# EAGLE design arduino (EAGLE 6.2)
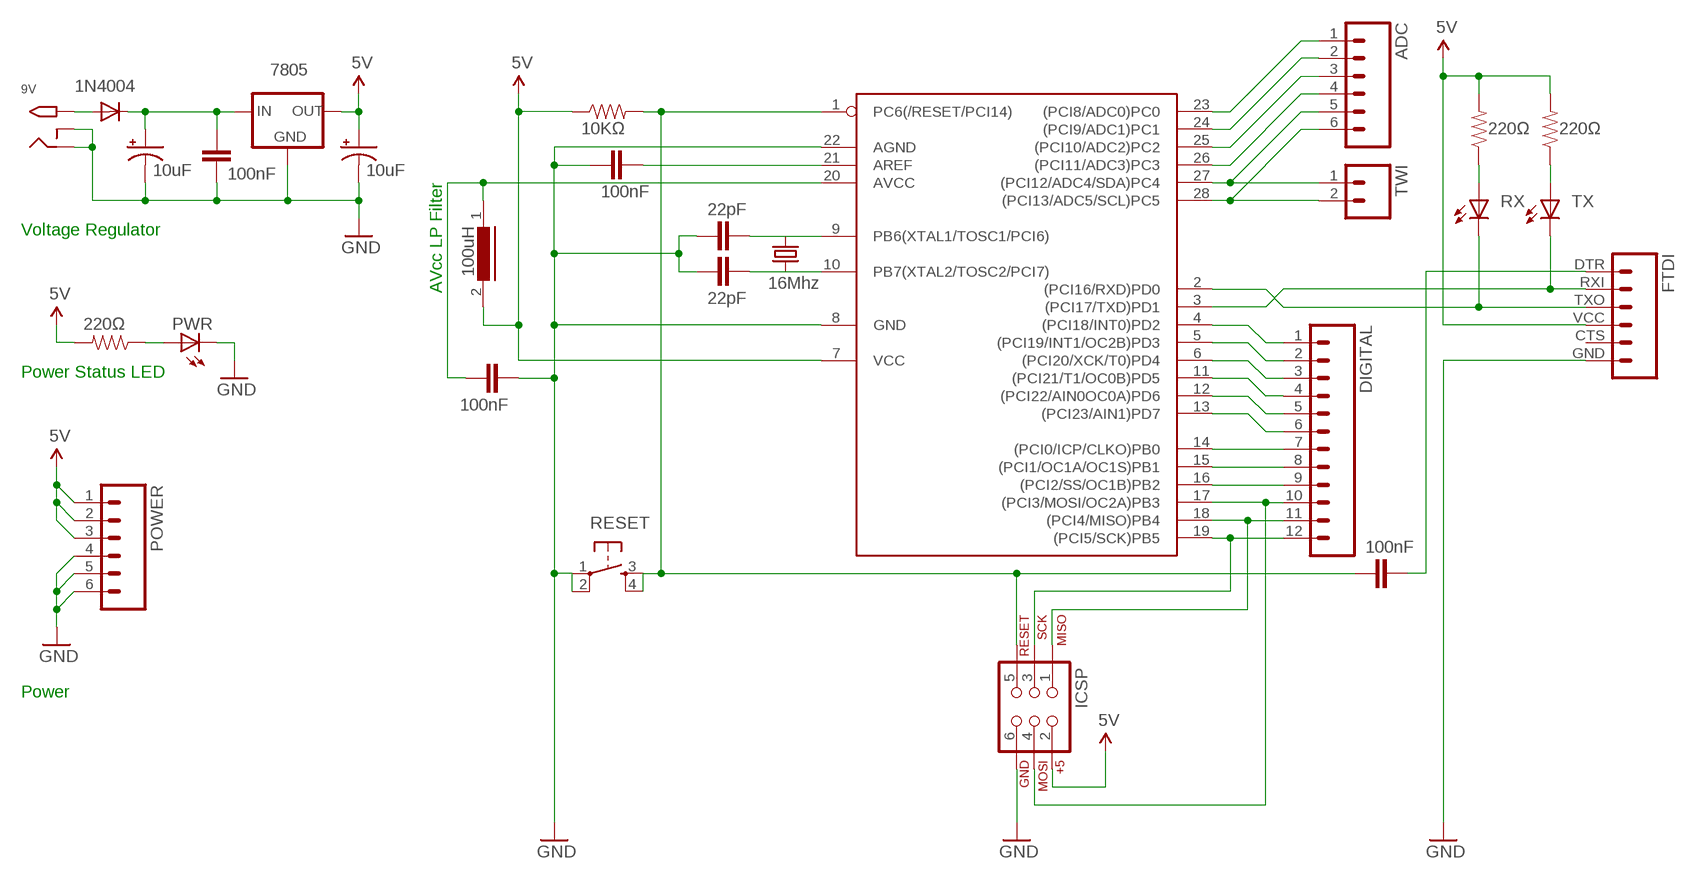
[diagram p0: schematic, sheet 1]

## Parts
9V  2.1MMJACKTHM  [PJ-102A]
ADC  M06LOCK  [1X06_LOCK]
AVR_C1  100nF  CAPPTH1  [CAP-PTH-5MM]
AVR_C2  22pF  CAPPTH1  [CAP-PTH-5MM]
AVR_C3  22pF  CAPPTH1  [CAP-PTH-5MM]
AVR_C4  100nF  CAPPTH1  [CAP-PTH-5MM]
AVR_C5  100nF  CAPPTH1  [CAP-PTH-5MM]
AVR_R1  10KΩ  RESISTORPTH-1/4W  [AXIAL-0.4]
AVR_R2  220Ω  RESISTORPTH-1/4W  [AXIAL-0.4]
AVR_R3  220Ω  RESISTORPTH-1/4W  [AXIAL-0.4]
D1  1N4004  [DO41-10]
DIGITAL  M12LOCK  [1X12_LOCK]
FTDI  FTDI_BASICPTH  [FTDI_BASIC]
IC1  ATMEGA168-20P  [DIL28-3]
IC2  7805  V_REG_78XXSIDE  [78XXL]
ICSP  AVR_SPI_PRG_62X3_LOCK  [2X3_LOCK]
L1  100uH  MCC10  [MCC10]
POWER  M06LOCK  [1X06_LOCK]
PWR  LED5MM  [LED5MM]
PWR_C1  10uF  CAP_POLPTH2  [CPOL-RADIAL-10UF-25V]
PWR_C2  100nF  CAPPTH1  [CAP-PTH-5MM]
PWR_C3  10uF  CAP_POLPTH2  [CPOL-RADIAL-10UF-25V]
PWR_R1  220Ω  RESISTORPTH-1/4W  [AXIAL-0.4]
Q1  16Mhz  CRYSTALHC49S  [HC49/S]
RESET  TAC_SWITCHPTH  [TACTILE-PTH]
RX  LED5MM  [LED5MM]
TWI  M02LOCK  [1X02_LOCK]
TX  LED5MM  [LED5MM]

## Nets
5V: AVR_R1.P$1 AVR_R2.P$2 AVR_R3.P$2 FTDI.VCC IC1.7(VCC) IC2.OUT ICSP.2 L1.2 POWER.1 POWER.2 POWER.3 PWR_C3.1(+) PWR_R1.P$2
ADC0: ADC.1 IC1.23((PCI8/ADC0)PC0)
ADC1: ADC.2 IC1.24((PCI9/ADC1)PC1)
ADC2: ADC.3 IC1.25((PCI10/ADC2)PC2)
ADC3: ADC.4 IC1.26((PCI11/ADC3)PC3)
AREF: AVR_C1.2 IC1.21(AREF)
AVCC: AVR_C4.2 IC1.20(AVCC) L1.1
GND: 9V.RING 9V.RING_SW AVR_C1.1 AVR_C2.1 AVR_C3.1 AVR_C4.1 FTDI.GND IC1.8(GND) IC1.22(AGND) IC2.GND ICSP.6 POWER.4 POWER.5 POWER.6 PWR.K(C) PWR_C1.2(-) PWR_C2.1 PWR_C3.2(-) RESET.1 RESET.2
MISO: DIGITAL.11 IC1.18((PCI4/MISO)PB4) ICSP.1
MOSI: DIGITAL.10 IC1.17((PCI3/MOSI/OC2A)PB3) ICSP.4
N$1: AVR_R2.P$1 RX.A
N$2: AVR_R3.P$1 TX.A
N$4: PWR.A PWR_R1.P$1
N$11: AVR_C5.2 FTDI.DTR
N$16: 9V.TIP D1.A
N$23: DIGITAL.1 IC1.4((PCI18/INT0)PD2)
N$24: DIGITAL.2 IC1.5((PCI19/INT1/OC2B)PD3)
N$25: DIGITAL.3 IC1.6((PCI20/XCK/T0)PD4)
N$26: DIGITAL.4 IC1.11((PCI21/T1/OC0B)PD5)
N$27: DIGITAL.5 IC1.12((PCI22/AIN0OC0A)PD6)
N$28: DIGITAL.6 IC1.13((PCI23/AIN1)PD7)
N$29: DIGITAL.7 IC1.14((PCI0/ICP/CLKO)PB0)
N$30: DIGITAL.8 IC1.15((PCI1/OC1A/OC1S)PB1)
N$31: DIGITAL.9 IC1.16((PCI2/SS/OC1B)PB2)
RESET: AVR_C5.1 AVR_R1.P$2 IC1.1(PC6(/RESET/PCI14)) ICSP.5 RESET.3 RESET.4
RX: FTDI.TXO IC1.2((PCI16/RXD)PD0) RX.K(C)
SCK: DIGITAL.12 IC1.19((PCI5/SCK)PB5) ICSP.3
SCL: ADC.6 IC1.28((PCI13/ADC5/SCL)PC5) TWI.2
SDA: ADC.5 IC1.27((PCI12/ADC4/SDA)PC4) TWI.1
TX: FTDI.RXI IC1.3((PCI17/TXD)PD1) TX.K(C)
VCC: D1.C IC2.IN PWR_C1.1(+) PWR_C2.2
XTAL1: AVR_C2.2 IC1.9(PB6(XTAL1/TOSC1/PCI6)) Q1.2
XTAL2: AVR_C3.2 IC1.10(PB7(XTAL2/TOSC2/PCI7)) Q1.1
Unconnected: FTDI.CTS

## Notes on the sheet
- AVcc LP Filter
- Voltage Regulator
- Power Status LED
- Power

## Library data of the parts
9V = adafruit:2.1MMJACK: 2.1mm x 5.5mm THM DC jack with internal switch. Digikey part #PJ-102A, 4UCON part #05537 2.1mm x 5.5mm SMT DC jack with internal switch. Digikey part #PJ-002A-SMT, 4UCON part #03267 By microbuilder.eu & adafruit.com
ADC POWER = SparkFun:M06: Header 6 Standard 6-pin 0.1" header. Use with straight break away headers (SKU : PRT-00116), right angle break away headers (PRT-00553), swiss pins (PRT-00743), machine pins (PRT-00117), and female headers (PRT-00115). Molex polarized connector foot print use with SKU : PRT-08094 with associated crimp pins and housings. NOTES ON THE VARIANTS LOCK and LOCK_LONGPADS... This footprint was designed to help hold the alignment of a through-hole component (i.e. 6-pin header) while soldering it into place. You may notice that each hole has been shifted either up or down by 0.005 of an inch from it's more standard position (which is a perfectly straight line). This slight alteration caused the pins (the squares in the middle) to touch the edges of the holes. Because they are alternating, it causes a "brace" to hold the component in place. 0.005 has proven to be the perfect amount of "off-center" position when using our standard breakaway headers. Although looks a little odd when you look at the bare footprint, once you have a header in there, the alteration is very hard to notice. Also, if you push a header all the way into place, it is covered up entirely on the bottom side. This idea of altering the position of holes to aid alignment will be further integrated into the Sparkfun Library for other footprints. It can help hold any component with 3 or more connection pins.
AVR_C1-AVR_C5 PWR_C2 = SparkFun:CAP: Capacitor Standard 0603 ceramic capacitor, and 0.1" leaded capacitor.
AVR_R1-AVR_R3 PWR_R1 = SparkFun:RESISTOR: Resistor Basic schematic elements and footprints for 0603, 1206, and PTH resistors.
D1 = diode:1N4004: DIODE general purpose rectifier, 1 A
DIGITAL = SparkFun:M12: Header 12 Standard 12-pin 0.1" header. Use with straight break away headers (SKU : PRT-00116), right angle break away headers (PRT-00553), swiss pins (PRT-00743), machine pins (PRT-00117), and female headers (PRT-00115).
FTDI = SparkFun:FTDI_BASIC: FTDI Basic: 3.3V and 5V
IC1 = adafruit:ATMEGA168*P: MICROCONTROLLER 16 kBytes FLASH 1 kBytes SRAM 512 Bytes EEPROM USART 8-channel 10 bit ADC
IC2 = SparkFun:V_REG_78XX: Voltage Regulator Standard 7805 5V regulator. IGO (Input Ground Output). Spark Fun Electronics SKU : COM-00107
ICSP = SparkFun:AVR_SPI_PRG_6: AVR ISP 6 Pin This is the reduced ISP connector for AVR programming. Common on Arduino. This footprint will take up less PCB space and can be used with a 10-pin to 6-pin adapter such as SKU: BOB-08508
L1 = inductors:MCC10: INDUCTOR
PWR RX TX = adafruit:LED: LED OSRAM: - CHIPLED LG R971, LG N971, LY N971, LG Q971, LY Q971, LO R971, LY R971 LH N974, LH R974 LS Q976, LO Q976, LY Q976 LO Q996 - Hyper CHIPLED LW Q18S LB Q993, LB Q99A, LB R99A - SideLED LS A670, LO A670, LY A670, LG A670, LP A670 LB A673, LV A673, LT A673, LW A673 LH A674 LY A675 LS A676, LA A676, LO A676, LY A676, LW A676 LS A679, LY A679, LG A679 - Hyper Micro SIDELED® LS Y876, LA Y876, LO Y876, LY Y876 LT Y87S - SmartLED LW L88C, LW L88S LB L89C, LB L89S, LG L890 LS L89K, LO L89K, LY L89K LS L896, LA L896, LO L896, LY L896 - TOPLED LS T670, LO T670, LY T670, LG T670, LP T670 LSG T670, LSP T670, LSY T670, LOP T670, LYG T670 LG T671, LOG T671, LSG T671 LB T673, LV T673, LT T673, LW T673 LH T674 LS T676, LA T676, LO T676, LY T676, LB T676, LH T676, LSB T676, LW T676 LB T67C, LV T67C, LT T67C, LS T67K, LO T67K, LY T67K, LW E67C LS E67B, LA E67B, LO E67B, LY E67B, LB E67C, LV E67C, LT E67C LW T67C LS T679, LY T679, LG T679 LS T770, LO T770, LY T770, LG T770, LP T770 LB T773, LV T773, LT T773, LW T773 LH T774 LS E675, LA E675, LY E675, LS T675 LS T776, LA T776, LO T776, LY T776, LB T776 LHGB T686 LT T68C, LB T68C - Hyper Mini TOPLED® LB M676 - Mini TOPLED Santana® LG M470 LS M47K, LO M47K, LY M47K Source: http://www.osram.convergy.de/
PWR_C1 PWR_C3 = SparkFun:CAP_POL: Capacitor Polarized These are standard SMD and PTH capacitors. Normally 10uF, 47uF, and 100uF in electrolytic and tantalum varieties. Always verify the external diameter of the through hole cap, it varies with capacity, voltage, and manufacturer. The EIA devices should be standard.
Q1 = crystal:CRYSTAL: CRYSTAL; OC_FARNELL: 1667008; OC_NEWARK: unknown
RESET = SparkFun:TAC_SWITCH: Momentary Switch Button commonly used for reset or general input. Spark Fun Electronics SKU : COM-00097
TWI = SparkFun:M02: Header 2 Standard 2-pin 0.1" header. Use with straight break away headers (SKU : PRT-00116), right angle break away headers (PRT-00553), swiss pins (PRT-00743), machine pins (PRT-00117), and female headers (PRT-00115). Molex polarized connector foot print use with SKU : PRT-08233 with associated crimp pins and housings.

## Board
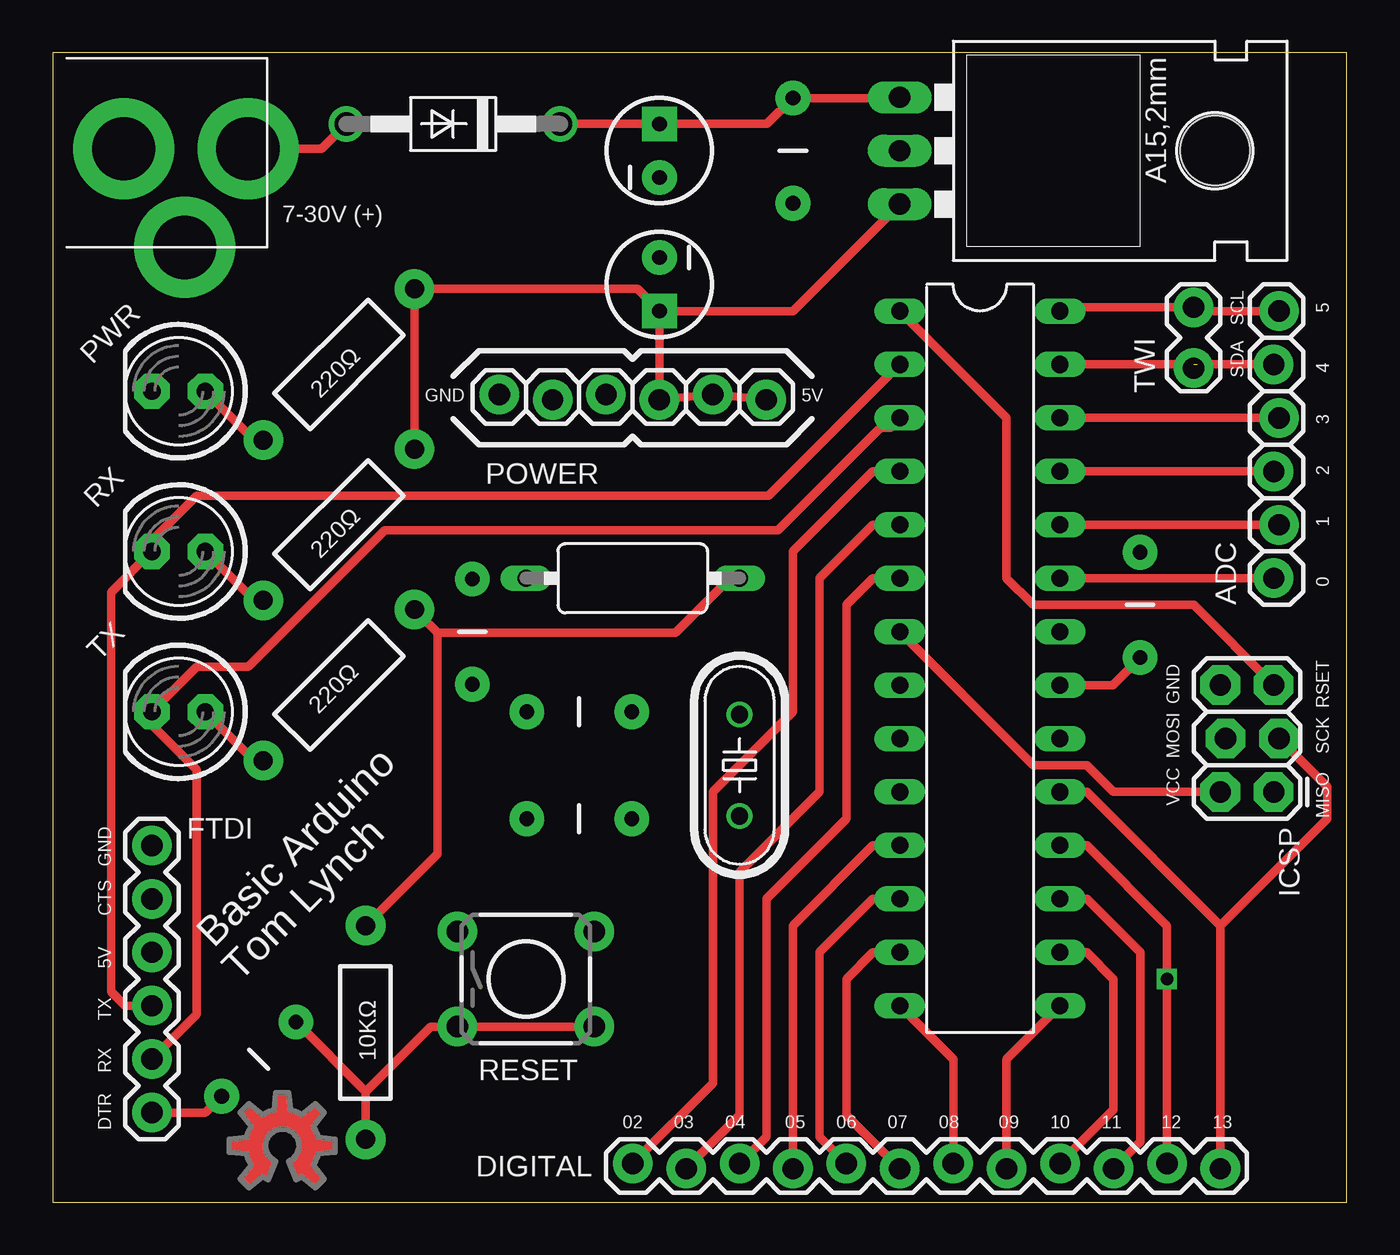
[diagram p1: board, top side]
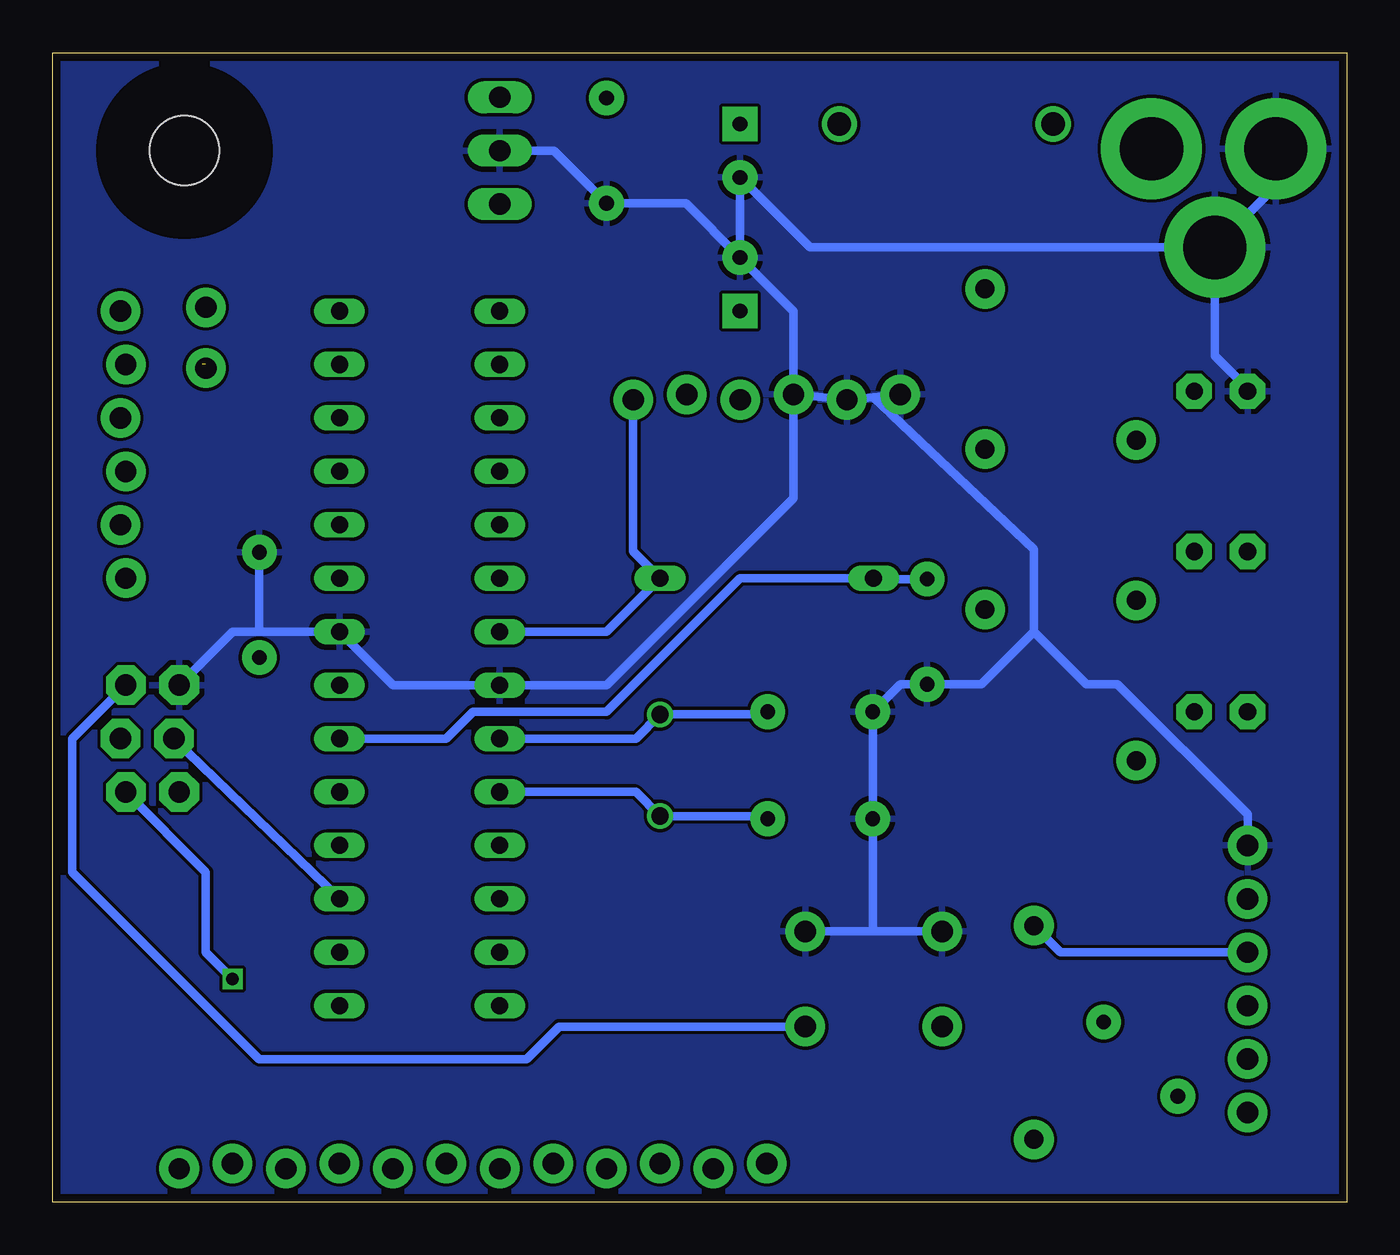
[diagram p2: board, bottom side, seen from below]

Size 61.54 x 54.65 mm. Coordinates in mm from the lower left corner, seen from the top.
Outline: 0,54.65 0,0 61.54,0 61.54,54.65 0,54.65
Copper layers (1*16): Top 0.0356mm / dielectric 1.5011mm / Bottom 0.0356mm
Design rules: minimum track width 6mil, minimum drill 13mil, track to track 6mil, track to pad 6mil, pad to pad 6mil, via to via 6mil, smd to smd 6mil, copper to edge 15mil, drill to drill 6mil, minimum pad ring 7mil, minimum via ring 7mil, stop-mask expansion 4mil, vias tented up to drill 0mil, thermal gap 10mil

### Footprints (pad centres in the part's own frame; a part is rotated, then mirrored left to right if it is on the bottom)
PJ-102A = drill 3 pad 4.8: RING 0.1,-3.39; RING_SW -4.6,-6.29; TIP 0.1,-9.29
1X06_LOCK = drill 1.016 pad 1.88: 1 0,0; 2 2.54,-0.254; 3 5.08,0; 4 7.62,-0.254; 5 10.16,0; 6 12.7,-0.254
CAP-PTH-5MM = drill 0.7 pad 1.651: 1 -2.5,0; 2 2.5,0
AXIAL-0.4 = drill 0.9 pad 1.88: P$1 -5.08,0; P$2 5.08,0
DO41-10 = drill 1.118: A 5.08,0; C -5.08,0
1X12_LOCK = drill 1.016 pad 1.88: 1 0,0.127; 2 2.54,-0.127; 3 5.08,0.127; 4 7.62,-0.127; 5 10.16,0.127; 6 12.7,-0.127; 7 15.24,0.127; 8 17.78,-0.127; 9 20.32,0.127; 10 22.86,-0.127; 11 25.4,0.127; 12 27.94,-0.127
FTDI_BASIC = drill 1.016 pad 1.88: CTS 10.16,0; DTR 0,0; GND 12.7,0; RXI 2.54,0; TXO 5.08,0; VCC 7.62,0
DIL28-3 = drill 0.813 long: 1 -16.51,-3.81; 2 -13.97,-3.81; 3 -11.43,-3.81; 4 -8.89,-3.81; 5 -6.35,-3.81; 6 -3.81,-3.81; 7 -1.27,-3.81; 8 1.27,-3.81; 9 3.81,-3.81; 10 6.35,-3.81; 11 8.89,-3.81; 12 11.43,-3.81; 13 13.97,-3.81; 14 16.51,-3.81; 15 16.51,3.81; 16 13.97,3.81; 17 11.43,3.81; 18 8.89,3.81; 19 6.35,3.81; 20 3.81,3.81; 21 1.27,3.81; 22 -1.27,3.81; 23 -3.81,3.81; 24 -6.35,3.81; 25 -8.89,3.81; 26 -11.43,3.81; 27 -13.97,3.81; 28 -16.51,3.81
78XXL = drill 1.016 long: GND 0,-3.81; IN -2.54,-3.81; OUT 2.54,-3.81 | hole 3.302: 0,11.176
2X3_LOCK = drill 1.016 pad 1.88 octagon: 1 0,0; 2 0,2.54; 3 2.54,-0.254; 4 2.54,2.286; 5 5.08,0; 6 5.08,2.54
MCC10 = drill 0.813 long: 1 -5.08,0; 2 5.08,0
LED5MM = drill 0.813 pad 1.676 octagon: A -1.27,0; K 1.27,0
CPOL-RADIAL-10UF-25V = drill 0.7 pad 1.651 square: 1 1.27,0 | drill 0.7 pad 1.651: 2 -1.27,0
HC49/S = drill 0.813: 1 -2.413,0; 2 2.413,0
TACTILE-PTH = drill 1.016 pad 1.88: 1 -3.251,2.261; 2 3.251,2.261; 3 -3.251,-2.261; 4 3.251,-2.261
1X02_LOCK = drill 1.016 pad 1.88: 1 -0.178,0; 2 2.718,0

### Placement (x,y rotation side)
9V  0,49.99 90 top
ADC  58.06,29.67 90 top
AVR_C1  51.71,28.4 270 top
AVR_C2  25.04,23.32 0 top
AVR_C3  25.04,18.24 0 top
AVR_C4  19.96,27.13 90 top
AVR_C5  9.8,6.81 225 top
AVR_R1  14.88,8.08 270 top
AVR_R2  13.61,32.21 45 top
AVR_R3  13.61,24.59 45 top
D1  19.05,51.26 180 top
DIGITAL  27.58,1.73 0 top
FTDI  4.72,4.27 90 top
IC1  44.09,25.86 270 top
IC2  44.09,49.99 270 top
ICSP  58.06,19.51 90 top
L1  27.58,29.67 0 top
POWER  33.93,38.15 180 top
PWR  5.99,38.56 180 top
PWR_C1  28.85,49.99 90 top
PWR_C2  35.2,49.99 90 top
PWR_C3  28.85,43.64 270 top
PWR_R1  13.61,39.83 45 top
Q1  32.66,20.78 90 top
RESET  22.5,10.62 0 top
RX  5.99,30.94 180 top
TWI  54.25,39.83 90 top
TX  5.99,23.32 180 top
U$7  [OSHWLOGO_TOP_0.2]  10.92,2.69 0 top

### Tracks (layer width: path | path; a pad name or v marks a point on that pad's centre or on a via)
5V
  Top 0.406: IC1.7 46.63,20.78 49.17,20.78 50.44,19.51 ICSP.2 | IC2.OUT 35.2,42.37 PWR_C3.1 | PWR_C3.1 POWER.3 POWER.2 POWER.1 | 18.31,27.08 29.62,27.08 32.21,29.67 L1.2 | PWR_C3.1 27.8,43.42 PWR_R1.P$2 AVR_R2.P$2 | AVR_R1.P$1 18.31,16.58 18.31,27.08 | AVR_R3.P$2 18.31,27.08
  Bottom 0.406: IC1.7 35.2,27.13 L1.2 33.93,30.94 POWER.1 | AVR_R1.P$1 13.61,11.89 FTDI.VCC
ADC0
  Top 0.406: IC1.23 ADC.1
ADC1
  Top 0.406: IC1.24 ADC.2
ADC2
  Top 0.406: ADC.3 IC1.25
ADC3
  Top 0.406: IC1.26 ADC.4
AREF
  Top 0.406: IC1.21 50.4,24.59 AVR_C1.2
AVCC
  Bottom 0.406: IC1.20 42.82,22.05 41.55,23.32 35.2,23.32 28.85,29.67 L1.1 22.46,29.63 AVR_C4.2
GND
  Bottom 0.406: PWR.K 4.66,38.62 6.29,40.24 9V.RING_SW | IC2.GND 37.7,49.99 PWR_C2.1 31.43,47.49 PWR_C3.2 | PWR_C3.2 PWR_C1.2 25.52,45.39 9V.RING_SW | ICSP.6 52.98,27.13 51.71,27.13 | 51.71,27.13 IC1.22 45.36,24.59 IC1.8 35.2,24.59 26.31,33.48 POWER.4 | POWER.6 22.52,38.28 | 22.52,38.28 POWER.5 POWER.4 | PWR_C3.2 26.31,42.37 POWER.4 | AVR_C1.1 51.71,27.13 | RESET.1 22.5,12.88 | 22.5,12.88 RESET.2 | 22.5,12.88 22.54,12.92 AVR_C3.1 AVR_C2.1 21.23,24.63 AVR_C4.1 17.38,24.63 14.88,27.13 | 14.88,27.13 14.88,31.05 22.52,38.28 | 9V.RING_SW 3.39,48.29 9V.RING | FTDI.GND 4.72,18.44 10.92,24.64 12.4,24.64 14.88,27.13
  pour Bottom: 0.36,54.31 61.32,54.31 61.32,0.25 0.36,0.25
MISO  (via drill 0.6)
  Top 0.406: DIGITAL.11 v52.98,10.62 52.98,13.16 49.17,16.97 IC1.18
  Bottom 0.406: ICSP.1 54.25,15.7 54.25,11.89 v52.98,10.62
MOSI
  Top 0.406: DIGITAL.10 51.71,2.87 51.71,11.89 49.17,14.43 IC1.17
  Bottom 0.406: ICSP.4 IC1.17
N$1
  Top 0.406: RX.A 9.59,28.62 AVR_R2.P$1
N$2
  Top 0.406: TX.A 9.59,21 AVR_R3.P$1
N$4
  Top 0.406: PWR_R1.P$1 9.59,36.24 PWR.A
N$11
  Top 0.406: FTDI.DTR 7.26,4.27 AVR_C5.2
N$16
  Top 0.406: 9V.TIP 12.8,50.09 D1.A
N$23
  Top 0.406: DIGITAL.1 31.39,5.66 31.39,19.51 35.2,23.32 35.2,30.94 39.01,34.75 IC1.4
N$24
  Top 0.406: DIGITAL.2 32.66,4.14 32.66,15.7 36.47,19.51 36.47,29.67 39.01,32.21 IC1.5
N$25
  Top 0.406: DIGITAL.3 33.93,3.12 33.93,14.43 37.74,18.24 37.74,28.4 39.01,29.67 IC1.6
N$26
  Top 0.406: DIGITAL.4 35.2,13.16 39.01,16.97 IC1.11
N$27
  Top 0.406: DIGITAL.5 36.47,3.12 36.47,11.89 39.01,14.43 IC1.12
N$28
  Top 0.406: DIGITAL.6 37.74,4.14 37.74,10.62 39.01,11.89 IC1.13
N$29
  Top 0.406: IC1.14 42.82,6.81 DIGITAL.7
N$30
  Top 0.406: IC1.15 45.36,6.81 DIGITAL.8
N$31
  Top 0.406: DIGITAL.9 50.44,4.39 50.44,10.62 49.17,11.89 IC1.16
RESET
  Top 0.406: IC1.1 45.36,37.29 45.36,29.67 46.63,28.4 54.25,28.4 ICSP.5 | AVR_C5.1 14.88,5.26 | 14.88,5.26 AVR_R1.P$2 | 14.88,5.26 17.98,8.36 RESET.3 RESET.4
  Bottom 0.406: RESET.4 37.47,8.36 39.01,6.81 51.71,6.81 60.6,15.7 60.6,22.05 ICSP.5
RX
  Top 0.406: IC1.2 34.04,33.58 6.86,33.58 4.72,31.45 RX.K 2.79,29.01 2.79,10.01 3.45,9.35 FTDI.TXO
SCK
  Top 0.406: ICSP.3 60.6,19.76 60.6,18.24 55.52,13.16 | 55.52,13.16 DIGITAL.12 | 55.52,13.16 49.17,19.51 IC1.19
SCL
  Top 0.406: ADC.6 54.43,42.37 TWI.2 48.08,42.55 IC1.28
SDA  (1 unrouted)
  Top 0.406: IC1.27 54.25,39.83 | ADC.5 54.43,39.83 TWI.1
TX
  Top 0.406: IC1.3 39.83,36.83 39.37,36.83 34.49,31.95 15.8,31.95 9.3,25.45 6.86,25.45 TX.K 4.72,22.71 6.86,20.57 6.86,8.94 FTDI.RXI
VCC
  Top 0.406: D1.C PWR_C1.1 33.97,51.26 PWR_C2.2 40.24,52.49 IC2.IN
XTAL1
  Bottom 0.406: IC1.9 33.81,22.05 Q1.2 27.67,23.19 AVR_C2.2
XTAL2
  Bottom 0.406: IC1.10 33.81,19.51 Q1.1 27.67,18.36 AVR_C3.2

### Text on the board
tNames: 7-30V (+) | SCL | 5 | SDA | 4 | GND | 5V | 3 | 2 | 1 | 0 | GND | RSET | MOSI | SCK | VCC | MISO | GND | CTS | 5V | Basic Arduino | Tom Lynch | TX | RX | DTR | 02 | 03 | 04 | 05 | 06 | 07 | 08 | 09 | 10 | 11 | 12 | 13